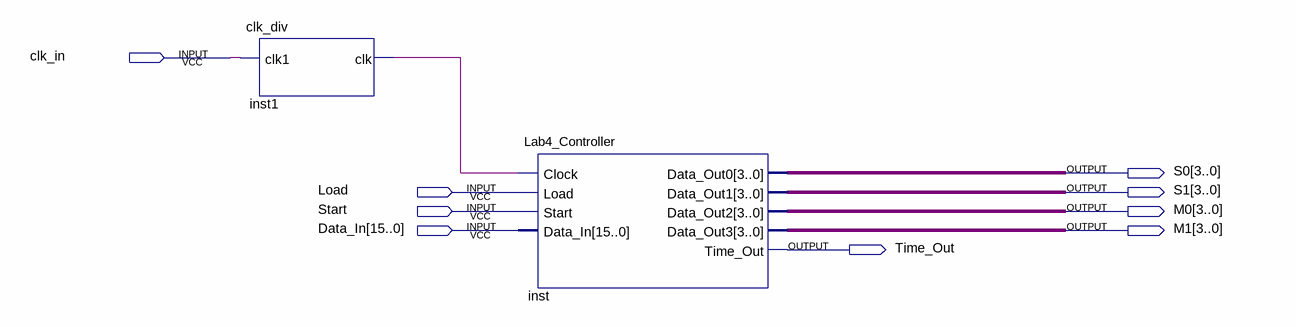
[diagram p0: schematic sheet]
// Quartus schematic Lab4No7Seg.bdf as structural Verilog: 2 symbols, 9 pins
module Lab4No7Seg (
  input  clk_in,
  input  Load,
  input  Start,
  input  [15:0] Data_In,
  output [3:0] S0,
  output [3:0] S1,
  output [3:0] M0,
  output [3:0] M1,
  output Time_Out
);

  wire inst1_clk;

  clk_div inst1 (.clk1(clk_in), .clk(inst1_clk));
  Lab4_Controller inst (
    .Clock(inst1_clk), .Load(Load), .Start(Start), .Data_In(Data_In), .Data_Out0(S0), .Data_Out1(S1),
    .Data_Out2(M0), .Data_Out3(M1), .Time_Out(Time_Out));
endmodule
